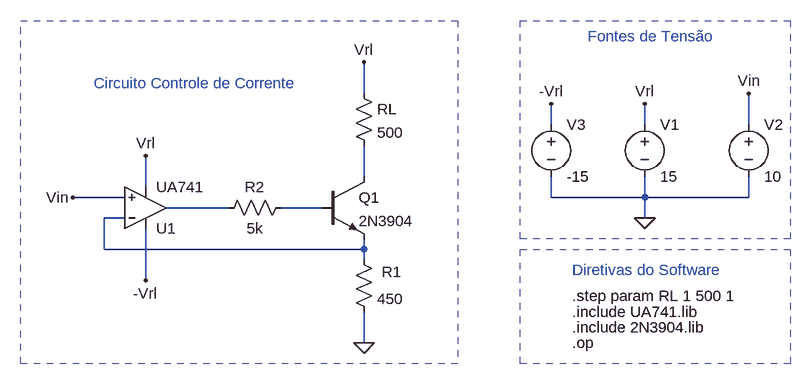
[diagram p0: schematic Trabalho1_Simu_1B_Teste.asc]
Trabalho1_Simu_1B_Teste.asc, the LTspice schematic file:
Version 4
SHEET 1 880 680
WIRE -480 80 -480 32
WIRE -192 128 -192 96
WIRE -48 128 -48 96
WIRE 112 128 112 80
WIRE -480 208 -480 160
WIRE -816 224 -816 176
WIRE -848 240 -928 240
WIRE -192 240 -192 208
WIRE -48 240 -48 208
WIRE -48 240 -192 240
WIRE 112 240 112 208
WIRE 112 240 -48 240
WIRE -688 256 -784 256
WIRE -544 256 -608 256
WIRE -848 272 -880 272
WIRE -48 272 -48 240
WIRE -880 320 -880 272
WIRE -480 320 -480 304
WIRE -480 320 -880 320
WIRE -480 336 -480 320
WIRE -816 368 -816 288
WIRE -480 464 -480 416
FLAG -480 464 0
FLAG -928 240 Vin
FLAG -480 32 Vrl
FLAG -48 96 Vrl
FLAG 112 80 Vin
FLAG -48 272 0
FLAG -816 176 Vrl
FLAG -192 96 -Vrl
FLAG -816 368 -Vrl
SYMBOL res -496 320 R0
WINDOW 0 43 35 Left 2
SYMATTR InstName R1
SYMATTR Value 450
SYMBOL res -592 240 R90
WINDOW 0 0 56 VBottom 2
WINDOW 3 32 56 VTop 2
SYMATTR InstName R2
SYMATTR Value 5k
SYMBOL res -496 64 R0
SYMATTR InstName RL
SYMATTR Value 500
SYMBOL voltage -48 112 R0
WINDOW 123 0 0 Left 0
WINDOW 39 0 0 Left 0
SYMATTR InstName V1
SYMATTR Value 15
SYMBOL voltage 112 112 R0
WINDOW 123 0 0 Left 0
WINDOW 39 0 0 Left 0
SYMATTR InstName V2
SYMATTR Value 10
SYMBOL OpAmps\\opamp2 -816 320 M180
SYMATTR InstName U1
SYMATTR Value UA741
SYMBOL npn -544 208 R0
SYMATTR InstName Q1
SYMATTR Value 2N3904
SYMBOL voltage -192 112 R0
WINDOW 123 0 0 Left 0
WINDOW 39 0 0 Left 0
SYMATTR InstName V3
SYMATTR Value -15
TEXT -160 464 Left 2 !.op
TEXT -896 64 Left 2 ;Circuito Controle de Corrente
TEXT -136 -8 Left 2 ;Fontes de Tensão
TEXT -160 352 Left 2 ;Diretivas do Software
TEXT -160 440 Left 2 !.include 2N3904.lib
TEXT -160 416 Left 2 !.include UA741.lib
TEXT -160 392 Left 2 !.step param RL 1 500 1
RECTANGLE Normal -336 496 -1008 -32 2
RECTANGLE Normal 176 304 -240 -32 2
RECTANGLE Normal 176 496 -240 320 2

The netlist it stands for:
* Trabalho1_Simu_1B_Teste.asc
R1 N004 0 450
R2 N003 N002 5k
RL Vrl N001 500
V1 Vrl 0 15
V2 Vin 0 10
XU1 Vin N004 -Vrl Vrl N002 UA741  ; pins In+ In- V+ V- OUT
Q1 N001 N003 N004 0 2N3904
V3 -Vrl 0 -15
.model NPN NPN
.model PNP PNP
.lib standard.bjt
.op
* Circuito Controle de Corrente
* Fontes de Tensão
* Diretivas do Software
.include 2N3904.lib
.include UA741.lib
.step param RL 1 500 1
.backanno
.end